# EAGLE design emonDCmini v0.7 RTC (EAGLE 8.3.2)
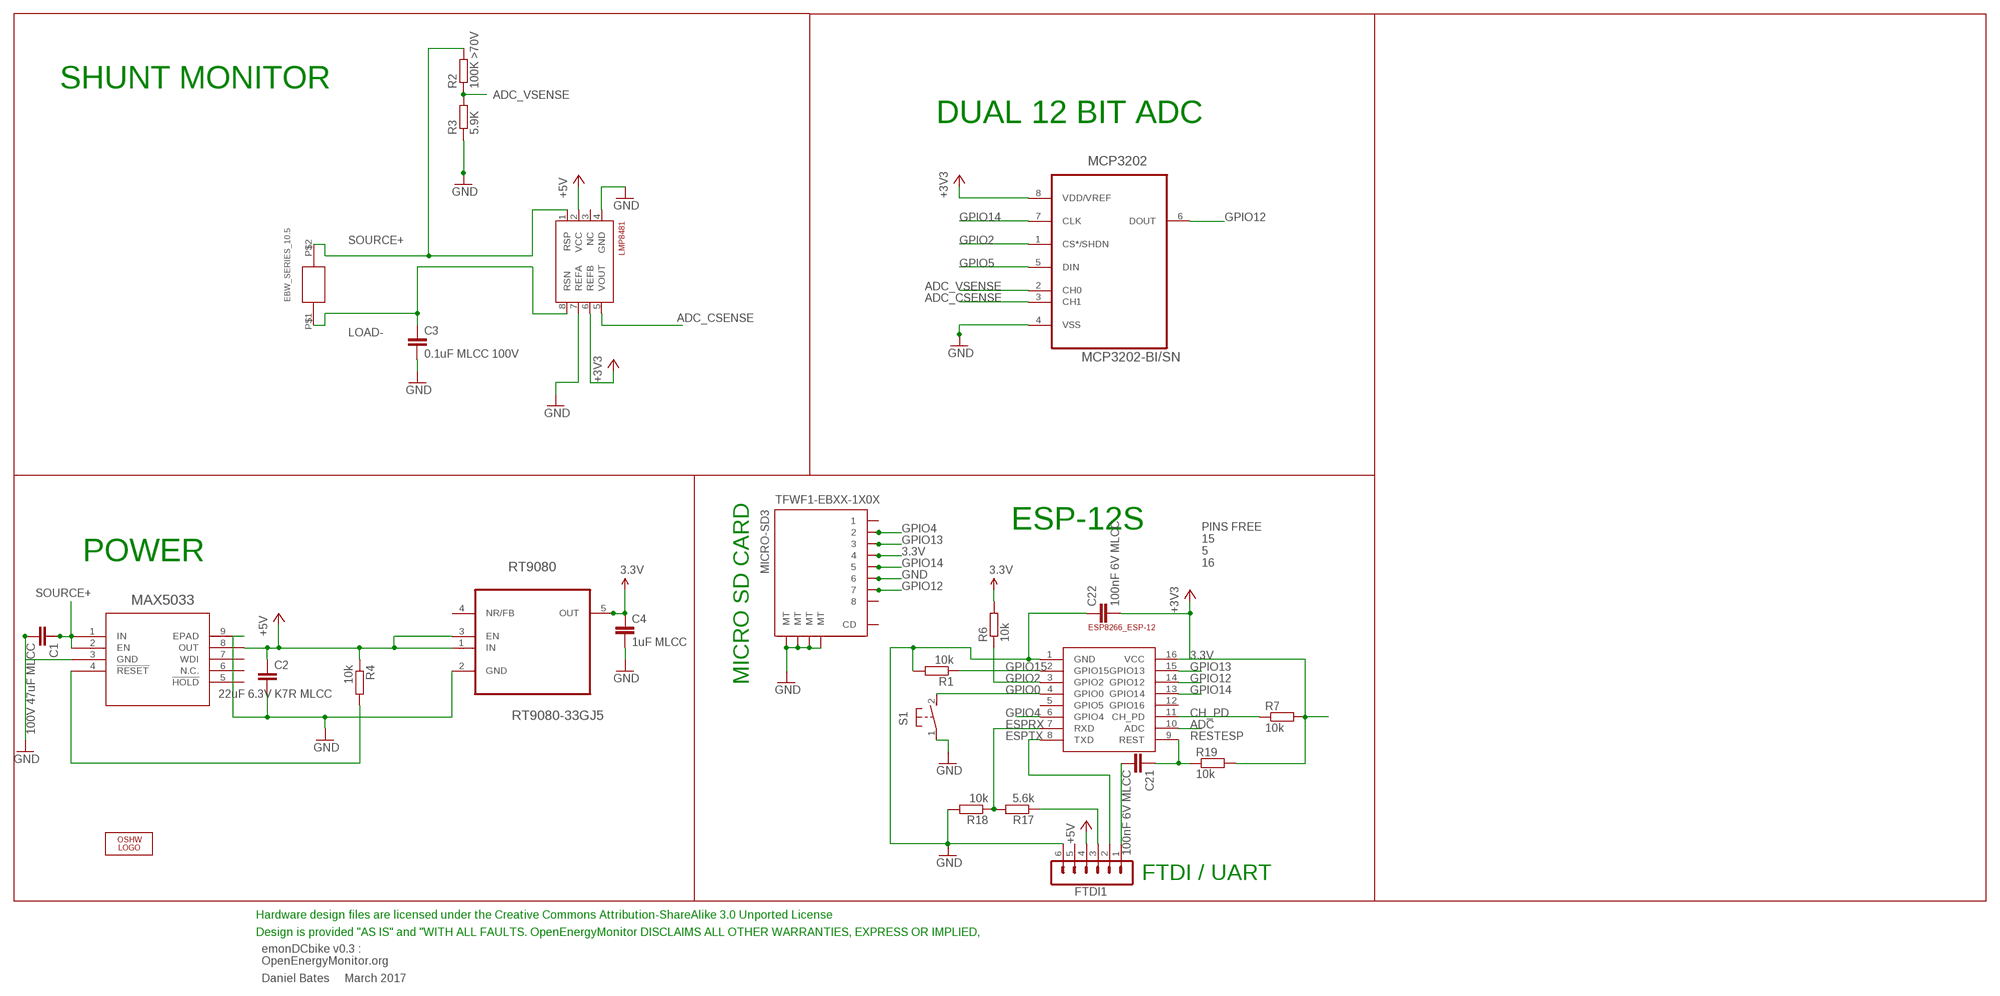
[diagram p0: schematic, sheet 1]

## Parts
C1  100V 47uF MLCC  C-EUC1206  [C1206]
C2  22uF 6.3V K7R MLCC  C-EUC1206  [C1206]
C3  0.1uF MLCC 100V  C-EUC0603  [C0603]
C4  1uF MLCC  C-EUC0603  [C0603]
C21  100nF 6V MLCC  C-EUC0603  [C0603]
C22  100nF 6V MLCC  C-EUC0603  [C0603]
EBW_SERIES_10.5  EBW_SERIES_10.5MM  [EBW_SERIES_10.5MM]
ESP-12  ESP8266_ESP-12  [ESP8266-ESP12]
FTDI1  FTDI-ESP  MA06-1  [MA06-1]
LMP8481  LMP8481-H  LMP8481LMP8481-H  [S-PDSO-G08]
LOGO1  OSHW_LOGO_6MILX0200-NT  [OSHW_6X200_NOTEXT]
MAX5033  MAX5033BUSA+  [21-0111D_SBE-14]
MCP3202  MCP3202-BI/SN  [SOIC127P600X175-8N]
R1  10k  R-EU_R0603  [R0603]
R2  100K >70V  R-EU_R0603  [R0603]
R3  5.9K  R-EU_R0603  [R0603]
R4  10k  R-EU_R0603  [R0603]
R6  10k  R-EU_R0603  [R0603]
R7  10k  R-EU_R0603  [R0603]
R17  5.6k  R-EU_R0603  [R0603]
R18  10k  R-EU_R0603  [R0603]
R19  10k  R-EU_R0603  [R0603]
RT9080  RT9080-33GJ5  [TSOT-23-5]
S1  DTSM-3  [DTSM-3]
TFWF1-EBXX-1X0X  MICRO-SD3  [TF-MICRO-SD_PP3*]

## Nets
3.3V: C4.1 C22.2 ESP-12.16(VCC) LMP8481.6(REFB) MCP3202.8(VDD/VREF) R6.2 R7.2 R19.2 RT9080.5(OUT) TFWF1-EBXX-1X0X.4 ; supply symbol labelled +3V3
+5V: C2.1 FTDI1.4 MAX5033.8(OUT) R4.1 RT9080.1(IN) RT9080.3(EN)
ADC: ESP-12.10(ADC)
ADC_CSENSE: LMP8481.5(VOUT) MCP3202.3(CH1)
ADC_VSENSE: MCP3202.2(CH0) R2.1 R3.2
CH_PD: ESP-12.11(CH_PD) R7.1
ESPRX: ESP-12.7(RXD) R17.2 R18.1
ESPTX: ESP-12.8(TXD) FTDI1.2
GND [thin_power]: C1.2 C2.2 C3.2 C4.2 C22.1 ESP-12.1(GND) FTDI1.6 LMP8481.4(GND) LMP8481.7(REFA) MAX5033.3(GND) MAX5033.9(EPAD) MCP3202.4(VSS) R1.2 R3.1 R18.2 RT9080.2(GND) S1.1 TFWF1-EBXX-1X0X.6 TFWF1-EBXX-1X0X.MT1(MT) TFWF1-EBXX-1X0X.MT2(MT) TFWF1-EBXX-1X0X.MT3(MT) TFWF1-EBXX-1X0X.MT4(MT)
GPIO0: ESP-12.4(GPIO0) S1.2
GPIO2: ESP-12.3(GPIO2) MCP3202.1(CS*/SHDN) R6.1
GPIO4: ESP-12.6(GPIO4) TFWF1-EBXX-1X0X.2
GPIO5: MCP3202.5(DIN)
GPIO12: ESP-12.14(GPIO12) MCP3202.6(DOUT) TFWF1-EBXX-1X0X.7
GPIO13: ESP-12.15(GPIO13) TFWF1-EBXX-1X0X.3
GPIO14: ESP-12.13(GPIO14) MCP3202.7(CLK) TFWF1-EBXX-1X0X.5
GPIO15: ESP-12.2(GPIO15) R1.1
LOAD- [power]: C3.1 EBW_SERIES_10.5.P$1 LMP8481.8(RSN)
N$1: MAX5033.4(!RESET) R4.2
N$36: FTDI1.3 R17.1
RESTESP: C21.1 ESP-12.9(REST) R19.1
RST: C21.2 FTDI1.1
SOURCE+ [power]: C1.1 EBW_SERIES_10.5.P$2 LMP8481.1(RSP) MAX5033.1(IN) MAX5033.2(EN) R2.2
Unconnected: ESP-12.5(GPIO5) ESP-12.12(GPIO16) FTDI1.5 LMP8481.2(VCC) LMP8481.3(NC) MAX5033.5(!HOLD) MAX5033.6(N.C.) MAX5033.7(WDI) RT9080.4(NR/FB) TFWF1-EBXX-1X0X.1 TFWF1-EBXX-1X0X.8 TFWF1-EBXX-1X0X.CD

## Notes on the sheet
- SHUNT MONITOR
- DUAL 12 BIT ADC
- ESP-12S
- POWER
- PINS FREE
  15
  5
  16
- MAX5033
- MICRO SD CARD
- FTDI / UART
- Hardware design files are licensed under the Creative Commons Attribution-ShareAlike 3.0 Unported License
- Design is provided "AS IS" and "WITH ALL FAULTS. OpenEnergyMonitor DISCLAIMS ALL OTHER WARRANTIES, EXPRESS OR IMPLIED,
- emonDCbike v0.3 :
  OpenEnergyMonitor.org
- Daniel Bates     March 2017

## Library data of the parts
C1-C4 C21 C22 = rcl:C-EU: CAPACITOR, European symbol
EBW_SERIES_10.5 = EBW series shunt:EBW_SERIES_10.5MM
ESP-12 = ESP8266-ESP12:ESP8266_ESP-12
FTDI1 = JeeLabs:MA06-1: PIN HEADER
LMP8481 = lmp8481b:LMP8481: LMP8481MM-H/NOPB 100V/V
LOGO1 = ohw-logo:OSHW_LOGO_6MIL; OC_FARNELL: unknown
MAX5033 = MAX5033:MAX5033BUSA+: VOLTAGE REGULATOR 3.3V; MANUFACTURER_PART_NUMBER: MAX5033BUSA+; VENDOR: MAXIM
MCP3202 = Microchip-MCP3202-BI_SN:MCP3202-BI/SN: IC ADC 12BIT 2.7V 2CH SPI,SOIC-8; MPN: MCP3202-BI/SN; OC_FARNELL: 1196803; OC_NEWARK: 96K3721; PACKAGE: SOIC-8; SUPPLIER: Microchip
R1 R4 R6 R7 R17-R19 = rcl:R-EU_: RESISTOR, European symbol
R2 = rcl:R-EU_: RESISTOR, European symbol; MPN: MCWR06X1003FTL
R3 = rcl:R-EU_: RESISTOR, European symbol; MPN: MCWR06X5901FTL
RT9080 = TSOT-23-5 REGULATOR 3.3v:RT9080-33GJ5: Low-Dropout Regulator; OC_FARNELL: 2679852; PACKAGE: SOT-23-5
S1 = switch-tact:DTSM-3
TFWF1-EBXX-1X0X = TFWF1-EBXX-1X0X:MICRO-SD

## Net classes
1 power: width 1.016 mm
2 thin_power: width 0.254 mm

## Board
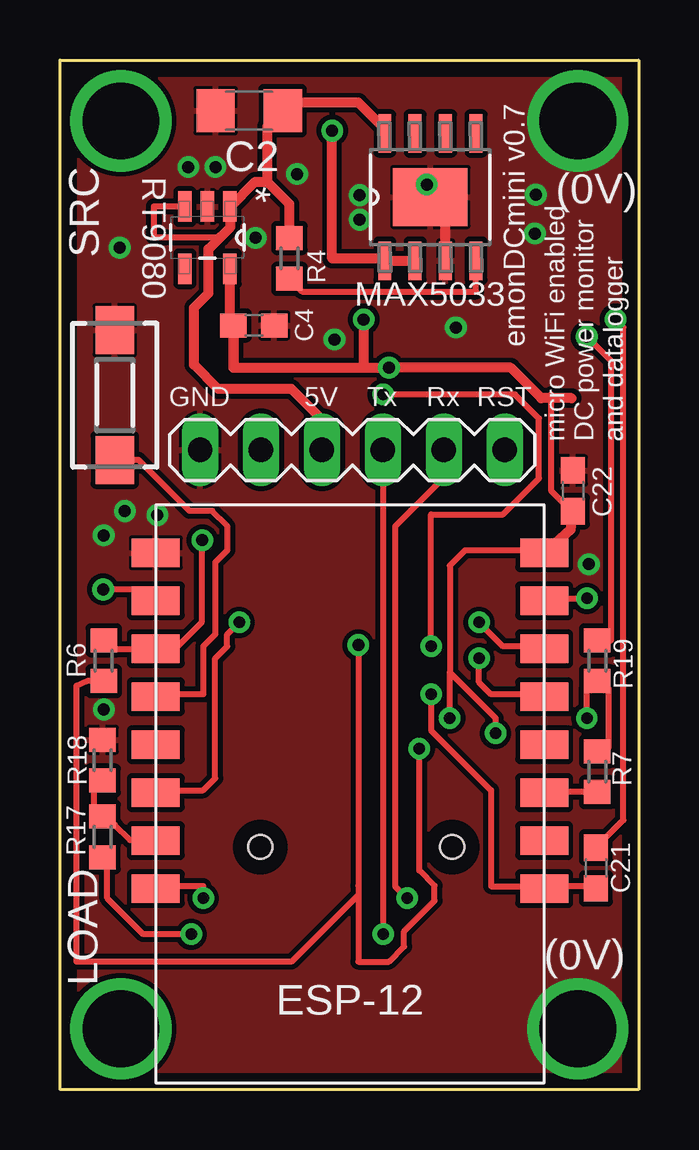
[diagram p1: board, top side]
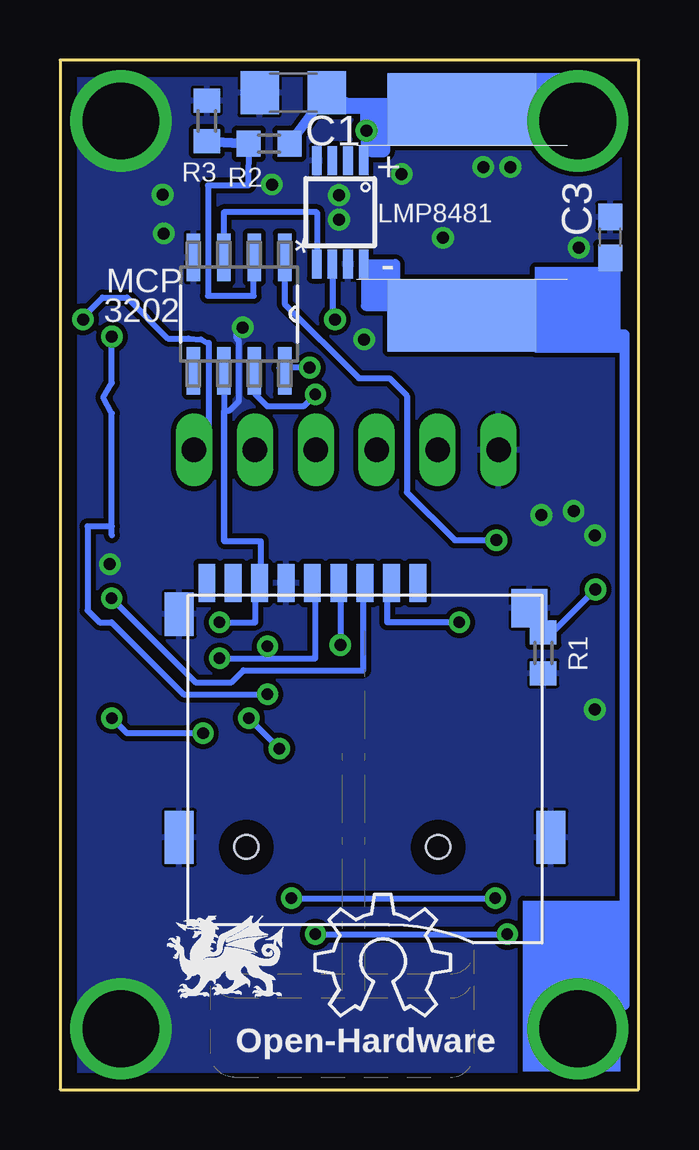
[diagram p2: board, bottom side, seen from below]

Size 24.13 x 42.93 mm. Coordinates in mm from the lower left corner, seen from the top.
Outline: 0,42.93 24.13,42.93 24.13,0 0,0 0,42.93
Copper layers (1*16): Top 0.035mm / dielectric 1.5mm / Bottom 0.035mm
Design rules "default *": minimum track width 10mil, minimum drill 19mil, track to track 8mil, track to pad 8mil, pad to pad 8mil, via to via 8mil, smd to smd 8mil, copper to edge 25mil, drill to drill 8mil, minimum pad ring 10mil, minimum via ring 8mil, stop-mask expansion 4mil, vias tented up to drill 0mil, thermal gap 5mil

### Footprints (pad centres in the part's own frame; a part is rotated, then mirrored left to right if it is on the bottom)
C1206 = smd 1.6 x 1.8: 1 -1.4,0; 2 1.4,0
C0603 = smd 1.1 x 1: 1 -0.85,0; 2 0.85,0
EBW_SERIES_10.5MM = smd 3 x 6.2: P$1 -4.3,0; P$2 4.3,0
ESP8266-ESP12 = smd 2 x 1.2: 1 16.2,2; 2 16.2,4; 3 16.2,6; 4 16.2,8; 5 16.2,10; 6 16.2,12; 7 16.2,14; 8 16.2,16; 9 0,16; 10 0,14; 11 0,12; 12 0,10; 13 0,8; 14 0,6; 15 0,4; 16 0,2
MA06-1 = drill 1.016 long: 1 0,0; 2 2.54,0; 3 5.08,0; 4 7.62,0; 5 10.16,0; 6 12.7,0
S-PDSO-G08 = smd 0.4 x 1.2: 1 -0.975,-2.157; 2 -0.325,-2.157; 3 0.325,-2.157; 4 0.975,-2.157; 5 0.975,2.157; 6 0.325,2.157; 7 -0.325,2.157; 8 -0.975,2.157
21-0111D_SBE-14 = smd 1.6 x 0.533: 1 -2.654,1.905; 2 -2.654,0.635; 3 -2.654,-0.635; 4 -2.654,-1.905; 5 2.654,-1.905; 6 2.654,-0.635; 7 2.654,0.635; 8 2.654,1.905 | smd 2.413 x 3.099: 9 0,0
SOIC127P600X175-8N = smd 1.981 x 0.559: 1 -2.362,1.905; 2 -2.362,0.635; 3 -2.362,-0.635; 4 -2.362,-1.905; 5 2.362,-1.905; 6 2.362,-0.635; 7 2.362,0.635; 8 2.362,1.905
R0603 = smd 1 x 1.1: 1 -0.85,0; 2 0.85,0
TSOT-23-5 = smd 1.27 x 0.559: 1 -1.295,0.94; 2 -1.295,0; 3 -1.295,-0.94; 4 1.295,-0.94; 5 1.295,0.94
DTSM-3 = smd 2 x 1.6: 1 -2.7,0; 2 2.7,0
TF-MICRO-SD_PP3* = smd 0.7 x 1.6: 1 2.2,11; 2 1.1,11; 3 0,11; 4 -1.1,11; 5 -2.2,11; 6 -3.3,11; 7 -4.4,11; 8 -5.5,11; CD -6.6,11 | smd 1.2 x 2.2: MT1 -7.75,0.4; MT2 7.75,0.4 | smd 1.2 x 1.8: MT3 -7.75,9.7 | smd 1.5 x 1.6: MT4 6.85,9.95 | hole 1: -4.95,0; 3.05,0

### Placement (x,y rotation side)
C1  14.4,41.56 180 bottom
C2  7.89,40.81 180 top
C3  1.19,35.53 90 bottom
C4  8.09,31.86 0 top
C21  22.35,9.25 90 top
C22  21.39,24.97 270 top
EBW_SERIES_10.5  7.37,36.58 90 bottom
ESP-12  20.19,24.38 180 top
FTDI1  18.54,26.67 180 top
LMP8481  12.45,36.58 180 bottom
LOGO1  13.5,3.07 0 bottom
MAX5033  15.44,37.21 90 top
MCP3202  16.66,32.33 270 bottom
R1  3.98,18.21 270 bottom
R2  15.41,39.44 0 bottom
R3  18,40.38 270 bottom
R4  9.57,34.66 270 top
R6  1.83,17.88 270 top
R7  22.4,13.26 90 top
R17  1.78,10.54 90 top
R18  1.78,13.74 90 top
R19  22.4,17.88 270 top
RT9080  6.15,35.52 270 top
S1  2.29,28.96 270 top
TFWF1-EBXX-1X0X  11.41,10.12 0 bottom
U$3  [DRAGON_LOGO_NOTEXT]  17.07,5.51 0 bottom

### Tracks (layer width: path | path; a pad name or v marks a point on that pad's centre or on a via)
3.3V  (via drill 0.48, 0.5)
  Top 0.254: R19.2 | 21.97,14.22 R7.2 22.86,14.22 22.86,16.76 R19.2 | R6.2 1.13,17.03 0.69,16.84 0.69,5.33 9.65,5.33 12.44,8.12 12.44,8.51 | C22.2 20.98,24.48 20.48,24.98 20.48,28.98 20.48,28.83 | v12.44,18.54 12.44,8.51 | v21.97,15.49 21.97,16.76 R19.2 | v18.16,14.86 18.16,15.49 16.26,17.4 | 16.26,17.4 16.26,21.84 16.89,22.48 20.07,22.48 ESP-12.16 | v16.26,15.49 16.26,17.4 | v14.99,14.22 14.99,9.14 15.62,8.51 15.62,7.87 14.35,6.6 14.35,5.97 13.72,5.33 12.45,5.33 12.45,8.51 12.44,8.51
  Top 0.406: C22.2 21.29,23.35 ESP-12.16 | 21.34,28.83 20.48,28.83 20.07,28.82 18.8,30.1 v13.72,30.1 12.66,30.1 | 7.24,30.11 | 7.24,30.11 C4.1 | C4.1 7.09,31.86 RT9080.5 | v12.66,32.11 12.66,30.1 | C4.1 7.24,30.1 12.66,30.1
  Bottom 0.254: v13.72,30.1 14.99,30.1 MCP3202.8 | LMP8481.6 12.77,32.22 | TFWF1-EBXX-1X0X.4 12.44,21.12 v12.44,18.54 | v21.97,15.49 21.34,14.86 v18.16,14.86 | v14.99,14.22 v16.26,15.49
  Bottom 0.406: 12.77,32.22 v12.66,32.11
+5V
  Top 0.254: 6.69,35.54 6.69,35.55 3.91,35.55 3.91,36.82 RT9080.3
  Top 0.406: FTDI1.4 10.92,27.94 9.65,29.21 6.6,29.21 5.59,30.23 5.59,32.6 6.2,33.2 6.2,35.05 6.69,35.54 7.11,35.96 | 9.29,41.05 C2.1 | R4.1 9.57,36.92 8.64,37.85 | RT9080.1 7.11,36.82 8.14,37.85 8.64,37.85 | MAX5033.8 13.54,40.1 13.49,40.1 12.45,41.15 9.62,41.15 C2.1 | C2.1 8.64,40.16 8.64,37.85
  Top 0.424: 7.11,35.96 7.11,36.82
ADC_CSENSE
  Bottom 0.254: MCP3202.3 17.3,36.58 13.42,36.58 LMP8481.5
ADC_VSENSE
  Bottom 0.254: 16,34.7 MCP3202.2 16.05,34.7 16.05,33.1 17.96,33.1 17.96,37.69 16.29,37.69 R2.1
  Bottom 0.406: R3.2 R2.1
CH_PD
  Top 0.254: R7.1 20.32,12.41 ESP-12.11
ESPRX
  Top 0.254: 4.11,10.38 arc90 ESP-12.7 | 3.56,10.41 3.97,10.41 ESP-12.7 | 1.9,11.37 R17.2 | R18.1 1.75,12.79 1.43,12.48 1.43,11.37 1.75,11.37 R17.2 | 3.56,10.41 2.92,10.41 2.29,11.05 R17.2 | 3.56,10.41 ESP-12.7
ESPTX  (via drill 0.48)
  Top 0.254: v5.98,7.98 5.98,8.48 4.48,8.48 ESP-12.8 | v14.48,7.98 13.98,8.48 13.98,23.48 15.98,25.48 15.98,26.48 FTDI1.2
  Bottom 0.254: v14.48,7.98 v5.98,7.98
GND  (via drill 0.5, 3.2)
  Top 0.254: ESP-12.1 4.19,22.48 4.22,22.29
  Top 0.406: MAX5033.3 16.08,36.58
  Bottom 0.254: 17.28,22.86 17.28,28.32 17.05,28.32 16.66,28.71 16.66,31.21 16.76,31.31 16.76,31.75
  other vias: 19.84,37.31 1.83,15.85 2.71,24.13 4.06,23.96 16.51,31.78 9.88,38.18 12.5,37.29 11.45,31.28 21.59,2.54 21.59,40.39 22.05,21.91 15.29,37.74 6.48,38.46 12.5,36.27 1.82,23.11 19.8,35.7 5.35,38.46 2.49,35.1 8.16,35.51
  pour Top: 0.25,42.67 23.88,42.67 23.88,0.25 0.25,0.25
  pour Bottom: 0.25,42.67 23.88,42.67 23.88,0.25 0.25,0.25
GPIO0
  Top 0.254: S1.2 3.28,26.26 5.4,24.13 6.35,24.13 6.96,23.52 6.98,23.48 6.98,22.48 6.48,21.98 6.48,18.98 5.98,18.48 5.98,16.48 4.48,16.48 ESP-12.4
GPIO2  (via drill 0.5)
  Top 0.254: R6.1 1.84,18.38 ESP-12.3 4.8,18.38 5.92,19.5 5.92,23.15 v5.93,22.91
  Bottom 0.254: MCP3202.1 14.76,32.75 11.67,29.66 10.39,29.66 9.66,28.94 9.66,24.91 7.67,22.91 v5.93,22.91
GPIO4  (via drill 0.48)
  Top 0.254: v7.48,19.48 6.98,18.98 6.98,18.48 6.48,17.98 6.48,12.98 5.98,12.48 4.48,12.48 ESP-12.6
  Bottom 0.254: v7.48,19.48 10.48,19.48 10.48,20.98 TFWF1-EBXX-1X0X.2
GPIO12  (via drill 0.48)
  Top 0.254: v17.48,19.48 18.48,18.48 19.98,18.48 ESP-12.14
  Bottom 0.254: v17.48,19.48 15.98,19.48 15.98,20.98 TFWF1-EBXX-1X0X.7 15.75,21.12 15.75,22.86 17.26,22.86 17.26,29.08 17.3,29.08 MCP3202.6
GPIO13  (via drill 0.48)
  Top 0.254: v21.98,20.48 20.48,20.48 ESP-12.15
  Bottom 0.254: v21.98,20.48 18.48,16.98 16.98,16.98 16.48,17.48 11.48,17.48 11.48,20.98 TFWF1-EBXX-1X0X.3
GPIO14  (via drill 0.48)
  Top 0.254: v17.48,17.98 17.48,16.98 17.98,16.48 19.98,16.48 ESP-12.13 | v13.48,28.98 18.98,28.98 19.98,27.98 19.98,25.48 18.48,23.98 15.48,23.98 v15.48,18.48
  Bottom 0.254: v17.48,17.98 15.48,17.98 | 15.48,17.98 13.48,17.98 13.48,20.98 TFWF1-EBXX-1X0X.5 | v13.48,28.98 13.98,28.48 15.48,28.48 15.98,28.98 15.98,29.48 MCP3202.7 | 15.48,17.98 v15.48,18.48
GPIO15  (via drill 0.5)
  Top 0.254: ESP-12.2 3.52,20.85 v1.8,20.85
  Bottom 0.254: v1.8,20.85 3.59,19.06 R1.1
LOAD-  (via drill 3.2)
  Bottom 0.254: 11.43,34.29 11.47,34.33 LMP8481.8
  Bottom 0.406: 1.2,31.5 6.59,31.5 EBW_SERIES_10.5.P$1 7.37,33.27 10.16,33.27 10.16,34.42 LMP8481.8 | 1.2,31.5 0.58,31.5 0.58,3.53 2.54,3.53 v2.54,2.54 | 11.43,34.29 11.37,34.31 11.37,32.67 10.28,32.65 10.28,32.66 10.34,32.66 10.34,34.17 11.19,34.17 11.19,34.18 11.18,34.18 11.18,32.99 10.55,32.99 10.55,32.94 10.59,32.94 10.59,33.92 10.87,33.92 10.87,33.96 10.89,33.96 10.89,33.23 | C3.1 1.2,34.68 1.2,31.5
N$1
  Top 0.254: R4.2 10.1,33.27 17.35,33.27 MAX5033.4
N$36  (via drill 0.48)
  Top 0.254: v5.48,6.48 3.48,6.48 1.98,7.98 1.98,9.48 R17.1 | v13.48,6.48 13.48,26.48 FTDI1.3
  Bottom 0.254: v13.48,6.48 v5.48,6.48
RESTESP  (via drill 0.48, 0.5)
  Top 0.254: C21.1 21.97,8.51 20.7,8.51 ESP-12.9 19.98,8.48 17.98,8.48 17.98,12.48 15.48,14.98 v15.48,16.48 | R19.1 22.99,18.73 22.99,30.37 v21.97,31.39
  Bottom 0.254: v21.97,31.39 21.97,29.46 22.33,28.85 21.97,28.19 21.97,23.48 | 21.97,23.11 21.97,23.48 | v15.48,16.48 18.98,16.48 21.98,19.48 22.48,19.48 22.98,19.98 22.98,23.48 21.97,23.48
RST  (via drill 0.5)
  Top 0.254: C21.2 23.49,11.24 23.49,31.78 v23.17,32.11
  Bottom 0.254: v23.17,32.11 23.17,32.2 22.35,33.02 21.34,33.02 19.63,31.32 18.77,31.32 18.25,31.28 17.97,31.12 17.93,31.12 17.93,26.67 FTDI1.1
SOURCE+  (via drill 0.5, 3.2)
  Top 0.406: MAX5033.1 13.54,34.59 | v11.35,39.98 11.35,34.65 13.54,34.65 MAX5033.1 | MAX5033.1 MAX5033.2
  Bottom 0.254: v11.35,39.98 11.47,40.02 | 11.47,40.02 LMP8481.1 | 11.49,40.85 11.49,40.02 | 11.49,40.02 11.49,39.94 11.43,39.88 | 11.2,40.99 11.34,40.85 11.49,40.85 | 11.49,40.87 11.49,40.85 | 11.47,40.02 11.49,40.02
  Bottom 0.406: 7.37,41.63 EBW_SERIES_10.5.P$2 7.37,39.62 10.66,39.62 10.66,39.63 | 2.29,40.89 2.54,40.89 v2.54,40.39 | R2.2 C1.1 11.49,40.85 | 10.16,41.15 12.7,41.15 12.7,40.89 10.67,40.89 10.66,41.02
  Bottom 0.61: 10.66,41.02 10.66,39.63 10.67,39.16 11.1,39.16 11.1,40.89 11.2,40.99
  Bottom 1.016: 2.29,40.89 7.37,40.89 EBW_SERIES_10.5.P$2
(copper drawn outside any net)
  shapes: Bottom area x3

### Text on the board
bPlace: Open-Hardware
tNames: (0V) | SRC | emonDCmini v0.7 | GND | 5V | Tx | Rx | RST | micro WiFi enabled / DC power monitor / and datalogger | LOAD | (0V)
bNames: MCP | 3202
_tsilk: Designed in | North Wales | Made in UK
_bsilk: SMT V0.6 rev3 | emonTx | wireless energy monitoring node | SMT V0.6 rev3 | emonTx | SMT V0.6 rev3 | emonTx | Technology that helps us live within ecological limits | wireless energy monitoring node | wireless energy monitoring node | Designed in North Wales UK by Glyn Hudson & Trystan Lea | Technology that helps us live within ecological limits | Technology that helps us live within ecological limits | Designed in North Wales UK by Glyn Hudson & Trystan Lea | 165mm ant | 433Mhz | Designed in North Wales UK by Glyn Hudson & Trystan Lea | 165mm ant | 165mm ant | 433Mhz | 433Mhz | 868Mhz | 82mm ant | 82mm ant | 82mm ant | 868Mhz | 868Mhz | 78mm ant | 915Mhz | 78mm ant | 915Mhz | 78mm ant | 915Mhz | 165mm ant | 433Mhz | 82mm ant | 868Mhz | 78mm ant | 915Mhz